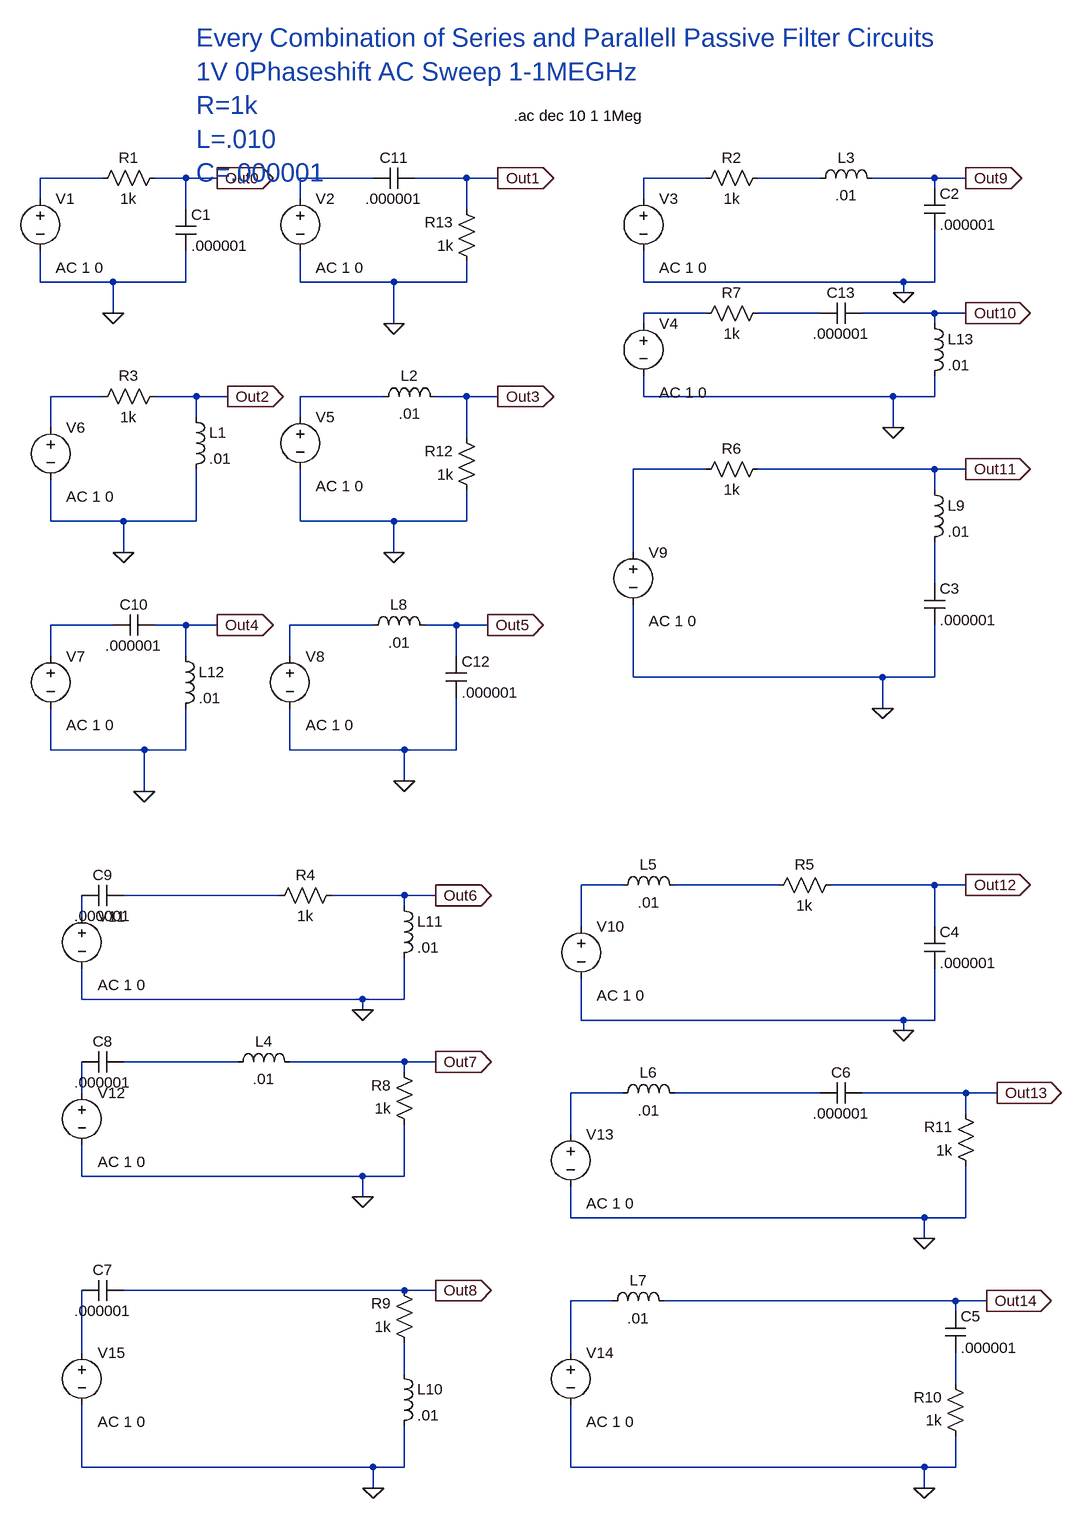
[diagram p0: schematic 2_everyPassiveSeriesCircuit_VoltageSource_Sim.asc]
2_everyPassiveSeriesCircuit_VoltageSource_Sim.asc, the LTspice schematic file:
Version 4
SHEET 1 1920 2148
WIRE -912 64 -1008 64
WIRE -784 64 -832 64
WIRE -736 64 -784 64
WIRE -496 64 -608 64
WIRE -352 64 -432 64
WIRE -304 64 -352 64
WIRE 16 64 -80 64
WIRE 192 64 96 64
WIRE 368 64 272 64
WIRE 416 64 368 64
WIRE 368 80 368 64
WIRE -1008 96 -1008 64
WIRE -608 96 -608 64
WIRE -80 96 -80 64
WIRE -784 112 -784 64
WIRE -352 112 -352 64
WIRE -1008 224 -1008 176
WIRE -896 224 -1008 224
WIRE -784 224 -784 176
WIRE -784 224 -896 224
WIRE -608 224 -608 176
WIRE -464 224 -608 224
WIRE -352 224 -352 192
WIRE -352 224 -464 224
WIRE -80 224 -80 176
WIRE 320 224 -80 224
WIRE 368 224 368 144
WIRE 368 224 320 224
WIRE 320 240 320 224
WIRE -896 272 -896 224
WIRE 16 272 -80 272
WIRE 192 272 96 272
WIRE 368 272 256 272
WIRE 416 272 368 272
WIRE -464 288 -464 224
WIRE -80 288 -80 272
WIRE 368 288 368 272
WIRE -912 400 -992 400
WIRE -768 400 -832 400
WIRE -720 400 -768 400
WIRE -480 400 -608 400
WIRE -352 400 -400 400
WIRE -304 400 -352 400
WIRE -80 400 -80 368
WIRE 304 400 -80 400
WIRE 368 400 368 368
WIRE 368 400 304 400
WIRE -768 432 -768 400
WIRE -608 432 -608 400
WIRE -992 448 -992 400
WIRE 304 448 304 400
WIRE -352 464 -352 400
WIRE 16 512 -96 512
WIRE 368 512 96 512
WIRE 416 512 368 512
WIRE 368 544 368 512
WIRE -992 592 -992 528
WIRE -880 592 -992 592
WIRE -768 592 -768 512
WIRE -768 592 -880 592
WIRE -608 592 -608 512
WIRE -464 592 -608 592
WIRE -352 592 -352 544
WIRE -352 592 -464 592
WIRE -880 640 -880 592
WIRE -464 640 -464 592
WIRE -96 640 -96 512
WIRE 368 688 368 624
WIRE -896 752 -992 752
WIRE -784 752 -832 752
WIRE -736 752 -784 752
WIRE -496 752 -624 752
WIRE -368 752 -416 752
WIRE -320 752 -368 752
WIRE -992 800 -992 752
WIRE -784 800 -784 752
WIRE -624 800 -624 752
WIRE -368 800 -368 752
WIRE -96 832 -96 720
WIRE 288 832 -96 832
WIRE 368 832 368 752
WIRE 368 832 288 832
WIRE 288 880 288 832
WIRE -992 944 -992 880
WIRE -848 944 -992 944
WIRE -784 944 -784 880
WIRE -784 944 -848 944
WIRE -624 944 -624 880
WIRE -448 944 -624 944
WIRE -368 944 -368 864
WIRE -368 944 -448 944
WIRE -448 992 -448 944
WIRE -848 1008 -848 944
WIRE -112 1152 -176 1152
WIRE 128 1152 -32 1152
WIRE 368 1152 208 1152
WIRE 416 1152 368 1152
WIRE -640 1168 -880 1168
WIRE -448 1168 -560 1168
WIRE -400 1168 -448 1168
WIRE -448 1184 -448 1168
WIRE -944 1200 -944 1168
WIRE -176 1216 -176 1152
WIRE 368 1216 368 1152
WIRE -944 1328 -944 1280
WIRE -512 1328 -944 1328
WIRE -448 1328 -448 1264
WIRE -448 1328 -512 1328
WIRE -512 1344 -512 1328
WIRE -176 1360 -176 1296
WIRE 320 1360 -176 1360
WIRE 368 1360 368 1280
WIRE 368 1360 320 1360
WIRE 320 1376 320 1360
WIRE -704 1424 -880 1424
WIRE -448 1424 -624 1424
WIRE -400 1424 -448 1424
WIRE -448 1440 -448 1424
WIRE -944 1472 -944 1424
WIRE -112 1472 -192 1472
WIRE 192 1472 -32 1472
WIRE 416 1472 256 1472
WIRE 464 1472 416 1472
WIRE 416 1504 416 1472
WIRE -192 1536 -192 1472
WIRE -944 1600 -944 1552
WIRE -512 1600 -944 1600
WIRE -448 1600 -448 1520
WIRE -448 1600 -512 1600
WIRE -512 1632 -512 1600
WIRE -192 1664 -192 1616
WIRE 352 1664 -192 1664
WIRE 416 1664 416 1584
WIRE 416 1664 352 1664
WIRE 352 1696 352 1664
WIRE -448 1776 -880 1776
WIRE -400 1776 -448 1776
WIRE -128 1792 -192 1792
WIRE 400 1792 -48 1792
WIRE 448 1792 400 1792
WIRE 400 1808 400 1792
WIRE -944 1872 -944 1776
WIRE -192 1872 -192 1792
WIRE -448 1904 -448 1856
WIRE 400 1920 400 1872
WIRE -944 2048 -944 1952
WIRE -496 2048 -944 2048
WIRE -448 2048 -448 1984
WIRE -448 2048 -496 2048
WIRE -192 2048 -192 1952
WIRE 352 2048 -192 2048
WIRE 400 2048 400 2000
WIRE 400 2048 352 2048
WIRE -496 2080 -496 2048
WIRE 352 2080 352 2048
FLAG -896 272 0
FLAG -464 288 0
FLAG -880 640 0
FLAG -464 640 0
FLAG -448 992 0
FLAG -848 1008 0
FLAG 288 880 0
FLAG 304 448 0
FLAG 320 240 0
FLAG 320 1376 0
FLAG -512 1344 0
FLAG -512 1632 0
FLAG 352 1696 0
FLAG 352 2080 0
FLAG -496 2080 0
FLAG -736 64 Out0
IOPIN -736 64 Out
FLAG -304 64 Out1
IOPIN -304 64 Out
FLAG 416 64 Out9
IOPIN 416 64 Out
FLAG 416 272 Out10
IOPIN 416 272 Out
FLAG 416 512 Out11
IOPIN 416 512 Out
FLAG -720 400 Out2
IOPIN -720 400 Out
FLAG -304 400 Out3
IOPIN -304 400 Out
FLAG -736 752 Out4
IOPIN -736 752 Out
FLAG -320 752 Out5
IOPIN -320 752 Out
FLAG -400 1168 Out6
IOPIN -400 1168 Out
FLAG 416 1152 Out12
IOPIN 416 1152 Out
FLAG 464 1472 Out13
IOPIN 464 1472 Out
FLAG -400 1424 Out7
IOPIN -400 1424 Out
FLAG -400 1776 Out8
IOPIN -400 1776 Out
FLAG 448 1792 Out14
IOPIN 448 1792 Out
SYMBOL res -816 48 R90
WINDOW 0 0 56 VBottom 2
WINDOW 3 32 56 VTop 2
SYMATTR InstName R1
SYMATTR Value 1k
SYMBOL cap -800 112 R0
SYMATTR InstName C1
SYMATTR Value .000001
SYMBOL ind -784 416 R0
SYMATTR InstName L1
SYMATTR Value .01
SYMBOL voltage -1008 80 R0
WINDOW 123 24 122 Left 2
WINDOW 39 0 0 Left 0
SYMATTR InstName V1
SYMATTR Value ""
SYMATTR Value2 AC 1 0
SYMBOL voltage -608 80 R0
WINDOW 123 24 122 Left 2
WINDOW 39 0 0 Left 0
SYMATTR InstName V2
SYMATTR Value ""
SYMATTR Value2 AC 1 0
SYMBOL voltage -80 80 R0
WINDOW 123 24 122 Left 2
WINDOW 39 0 0 Left 0
SYMATTR InstName V3
SYMATTR Value ""
SYMATTR Value2 AC 1 0
SYMBOL voltage -80 272 R0
WINDOW 123 24 122 Left 2
WINDOW 39 0 0 Left 0
SYMATTR InstName V4
SYMATTR Value ""
SYMATTR Value2 AC 1 0
SYMBOL voltage -608 416 R0
WINDOW 123 24 122 Left 2
WINDOW 39 0 0 Left 0
SYMATTR InstName V5
SYMATTR Value ""
SYMATTR Value2 AC 1 0
SYMBOL voltage -992 432 R0
WINDOW 123 24 122 Left 2
WINDOW 39 0 0 Left 0
SYMATTR InstName V6
SYMATTR Value ""
SYMATTR Value2 AC 1 0
SYMBOL voltage -992 784 R0
WINDOW 123 24 122 Left 2
WINDOW 39 0 0 Left 0
SYMATTR InstName V7
SYMATTR Value ""
SYMATTR Value2 AC 1 0
SYMBOL voltage -624 784 R0
WINDOW 123 24 122 Left 2
WINDOW 39 0 0 Left 0
SYMATTR InstName V8
SYMATTR Value ""
SYMATTR Value2 AC 1 0
SYMBOL voltage -96 624 R0
WINDOW 123 24 122 Left 2
WINDOW 39 0 0 Left 0
SYMATTR InstName V9
SYMATTR Value ""
SYMATTR Value2 AC 1 0
SYMBOL voltage -176 1200 R0
WINDOW 123 24 122 Left 2
WINDOW 39 0 0 Left 0
SYMATTR InstName V10
SYMATTR Value ""
SYMATTR Value2 AC 1 0
SYMBOL voltage -944 1184 R0
WINDOW 123 24 122 Left 2
WINDOW 39 0 0 Left 0
SYMATTR InstName V11
SYMATTR Value ""
SYMATTR Value2 AC 1 0
SYMBOL voltage -944 1456 R0
WINDOW 123 24 122 Left 2
WINDOW 39 0 0 Left 0
SYMATTR InstName V12
SYMATTR Value ""
SYMATTR Value2 AC 1 0
SYMBOL voltage -192 1520 R0
WINDOW 123 24 122 Left 2
WINDOW 39 0 0 Left 0
SYMATTR InstName V13
SYMATTR Value ""
SYMATTR Value2 AC 1 0
SYMBOL voltage -192 1856 R0
WINDOW 123 24 122 Left 2
WINDOW 39 0 0 Left 0
SYMATTR InstName V14
SYMATTR Value ""
SYMATTR Value2 AC 1 0
SYMBOL voltage -944 1856 R0
WINDOW 123 24 122 Left 2
WINDOW 39 0 0 Left 0
SYMATTR InstName V15
SYMATTR Value ""
SYMATTR Value2 AC 1 0
SYMBOL res 112 48 R90
WINDOW 0 0 56 VBottom 2
WINDOW 3 32 56 VTop 2
SYMATTR InstName R2
SYMATTR Value 1k
SYMBOL res -816 384 R90
WINDOW 0 0 56 VBottom 2
WINDOW 3 32 56 VTop 2
SYMATTR InstName R3
SYMATTR Value 1k
SYMBOL res -544 1152 R90
WINDOW 0 0 56 VBottom 2
WINDOW 3 32 56 VTop 2
SYMATTR InstName R4
SYMATTR Value 1k
SYMBOL res 224 1136 R90
WINDOW 0 0 56 VBottom 2
WINDOW 3 32 56 VTop 2
SYMATTR InstName R5
SYMATTR Value 1k
SYMBOL res 112 496 R90
WINDOW 0 0 56 VBottom 2
WINDOW 3 32 56 VTop 2
SYMATTR InstName R6
SYMATTR Value 1k
SYMBOL res 112 256 R90
WINDOW 0 0 56 VBottom 2
WINDOW 3 32 56 VTop 2
SYMATTR InstName R7
SYMATTR Value 1k
SYMBOL res -432 1536 R180
WINDOW 0 36 76 Left 2
WINDOW 3 36 40 Left 2
SYMATTR InstName R8
SYMATTR Value 1k
SYMBOL res -432 1872 R180
WINDOW 0 36 76 Left 2
WINDOW 3 36 40 Left 2
SYMATTR InstName R9
SYMATTR Value 1k
SYMBOL res 416 2016 R180
WINDOW 0 36 76 Left 2
WINDOW 3 36 40 Left 2
SYMATTR InstName R10
SYMATTR Value 1k
SYMBOL res 432 1600 R180
WINDOW 0 36 76 Left 2
WINDOW 3 36 40 Left 2
SYMATTR InstName R11
SYMATTR Value 1k
SYMBOL res -336 560 R180
WINDOW 0 36 76 Left 2
WINDOW 3 36 40 Left 2
SYMATTR InstName R12
SYMATTR Value 1k
SYMBOL res -336 208 R180
WINDOW 0 36 76 Left 2
WINDOW 3 36 40 Left 2
SYMATTR InstName R13
SYMATTR Value 1k
SYMBOL cap 352 80 R0
SYMATTR InstName C2
SYMATTR Value .000001
SYMBOL cap 352 688 R0
SYMATTR InstName C3
SYMATTR Value .000001
SYMBOL cap 352 1216 R0
SYMATTR InstName C4
SYMATTR Value .000001
SYMBOL cap 384 1808 R0
SYMATTR InstName C5
SYMATTR Value .000001
SYMBOL cap 256 1456 R90
WINDOW 0 0 32 VBottom 2
WINDOW 3 32 32 VTop 2
SYMATTR InstName C6
SYMATTR Value .000001
SYMBOL cap -880 1760 R90
WINDOW 0 0 32 VBottom 2
WINDOW 3 32 32 VTop 2
SYMATTR InstName C7
SYMATTR Value .000001
SYMBOL cap -880 1408 R90
WINDOW 0 0 32 VBottom 2
WINDOW 3 32 32 VTop 2
SYMATTR InstName C8
SYMATTR Value .000001
SYMBOL cap -880 1152 R90
WINDOW 0 0 32 VBottom 2
WINDOW 3 32 32 VTop 2
SYMATTR InstName C9
SYMATTR Value .000001
SYMBOL cap -832 736 R90
WINDOW 0 0 32 VBottom 2
WINDOW 3 32 32 VTop 2
SYMATTR InstName C10
SYMATTR Value .000001
SYMBOL cap -432 48 R90
WINDOW 0 0 32 VBottom 2
WINDOW 3 32 32 VTop 2
SYMATTR InstName C11
SYMATTR Value .000001
SYMBOL cap -384 864 M180
WINDOW 0 24 56 Left 2
WINDOW 3 24 8 Left 2
SYMATTR InstName C12
SYMATTR Value .000001
SYMBOL cap 192 256 M90
WINDOW 0 0 32 VBottom 2
WINDOW 3 32 32 VTop 2
SYMATTR InstName C13
SYMATTR Value .000001
SYMBOL ind -496 416 R270
WINDOW 0 32 56 VTop 2
WINDOW 3 5 56 VBottom 2
SYMATTR InstName L2
SYMATTR Value .01
SYMBOL ind 176 80 R270
WINDOW 0 32 56 VTop 2
WINDOW 3 5 56 VBottom 2
SYMATTR InstName L3
SYMATTR Value .01
SYMBOL ind -720 1440 R270
WINDOW 0 32 56 VTop 2
WINDOW 3 5 56 VBottom 2
SYMATTR InstName L4
SYMATTR Value .01
SYMBOL ind -128 1168 R270
WINDOW 0 32 56 VTop 2
WINDOW 3 5 56 VBottom 2
SYMATTR InstName L5
SYMATTR Value .01
SYMBOL ind -128 1488 R270
WINDOW 0 32 56 VTop 2
WINDOW 3 5 56 VBottom 2
SYMATTR InstName L6
SYMATTR Value .01
SYMBOL ind -144 1808 R270
WINDOW 0 32 56 VTop 2
WINDOW 3 5 56 VBottom 2
SYMATTR InstName L7
SYMATTR Value .01
SYMBOL ind -512 768 R270
WINDOW 0 32 56 VTop 2
WINDOW 3 5 56 VBottom 2
SYMATTR InstName L8
SYMATTR Value .01
SYMBOL ind 352 528 R0
SYMATTR InstName L9
SYMATTR Value .01
SYMBOL ind -464 1888 R0
SYMATTR InstName L10
SYMATTR Value .01
SYMBOL ind -464 1168 R0
SYMATTR InstName L11
SYMATTR Value .01
SYMBOL ind -800 784 R0
SYMATTR InstName L12
SYMATTR Value .01
SYMBOL ind 352 272 R0
SYMATTR InstName L13
SYMATTR Value .01
TEXT -280 -32 Left 2 !.ac dec 10 1 1Meg
TEXT -768 -152 Left 4 ;Every Combination of Series and Parallell Passive Filter Circuits\n1V 0Phaseshift AC Sweep 1-1MEGHz \nR=1k\nL=.010\nC=.000001

The netlist it stands for:
* 2_everyPassiveSeriesCircuit_VoltageSource_Sim.asc
R1 Out0 N001 1k
C1 Out0 0 .000001
L1 Out2 0 .01
V1 N001 0 AC 1 0
V2 N002 0 AC 1 0
V3 N003 0 AC 1 0
V4 N005 0 AC 1 0
V5 N008 0 AC 1 0
V6 N007 0 AC 1 0
V7 N011 0 AC 1 0
V8 N012 0 AC 1 0
V9 N009 0 AC 1 0
V10 N013 0 AC 1 0
V11 N016 0 AC 1 0
V12 N018 0 AC 1 0
V13 N019 0 AC 1 0
V14 N021 0 AC 1 0
V15 N022 0 AC 1 0
R2 N004 N003 1k
R3 Out2 N007 1k
R4 Out6 N015 1k
R5 Out12 N014 1k
R6 Out11 N009 1k
R7 N006 N005 1k
R8 0 Out7 1k
R9 N023 Out8 1k
R10 0 N024 1k
R11 0 Out13 1k
R12 0 Out3 1k
R13 0 Out1 1k
C2 Out9 0 .000001
C3 N010 0 .000001
C4 Out12 0 .000001
C5 Out14 N024 .000001
C6 Out13 N020 .000001
C7 Out8 N022 .000001
C8 N017 N018 .000001
C9 N015 N016 .000001
C10 Out4 N011 .000001
C11 Out1 N002 .000001
C12 0 Out5 .000001
C13 N006 Out10 .000001
L2 N008 Out3 .01
L3 N004 Out9 .01
L4 N017 Out7 .01
L5 N013 N014 .01
L6 N019 N020 .01
L7 N021 Out14 .01
L8 N012 Out5 .01
L9 Out11 N010 .01
L10 N023 0 .01
L11 Out6 0 .01
L12 Out4 0 .01
L13 Out10 0 .01
.ac dec 10 1 1Meg
* Every Combination of Series and Parallell Passive Filter Circuits
* 1V 0Phaseshift AC Sweep 1-1MEGHz
* R=1k
* L=.010
* C=.000001
.backanno
.end

* Results of the author's LTspice run, read from the files saved beside the schematic
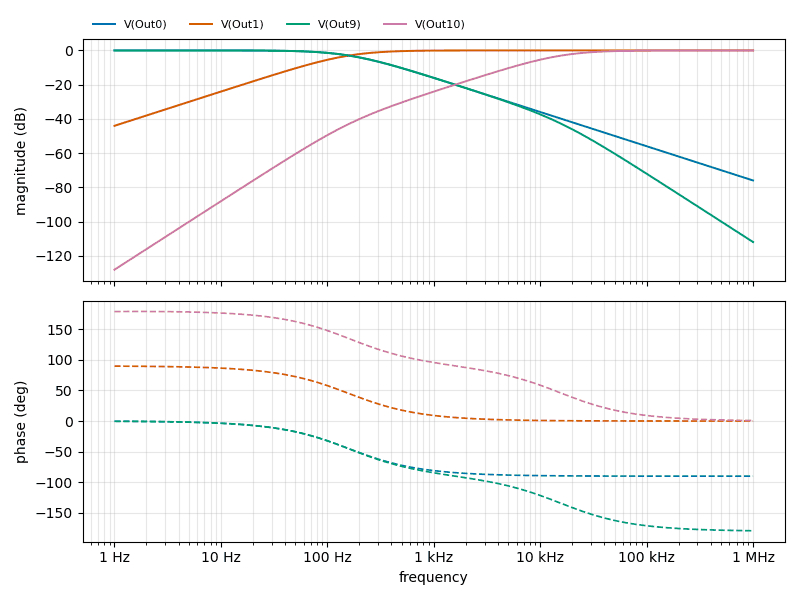
[diagram p1: AC Analysis of 2_everyPassiveSeriesCircuit_VoltageSource_Sim.asc, plotted from the saved traces]
* AC Analysis, 1 run:
*   V(Out0): -0.00 dB at 1 Hz, -75.96 dB at 1 MHz, peak -0.00 dB at 1 Hz, 3 dB below the peak at 159.1 Hz
*   V(Out1): -44.04 dB at 1 Hz, -0.00 dB at 1 MHz, peak -0.00 dB at 1 MHz, 3 dB below the peak at 159.2 Hz
*   V(Out9): -0.00 dB at 1 Hz, -111.93 dB at 1 MHz, peak -0.00 dB at 1 Hz, 3 dB below the peak at 160.5 Hz
*   V(Out10): -128.07 dB at 1 Hz, -0.00 dB at 1 MHz, peak -0.00 dB at 1 MHz, 3 dB below the peak at 15.76 kHz